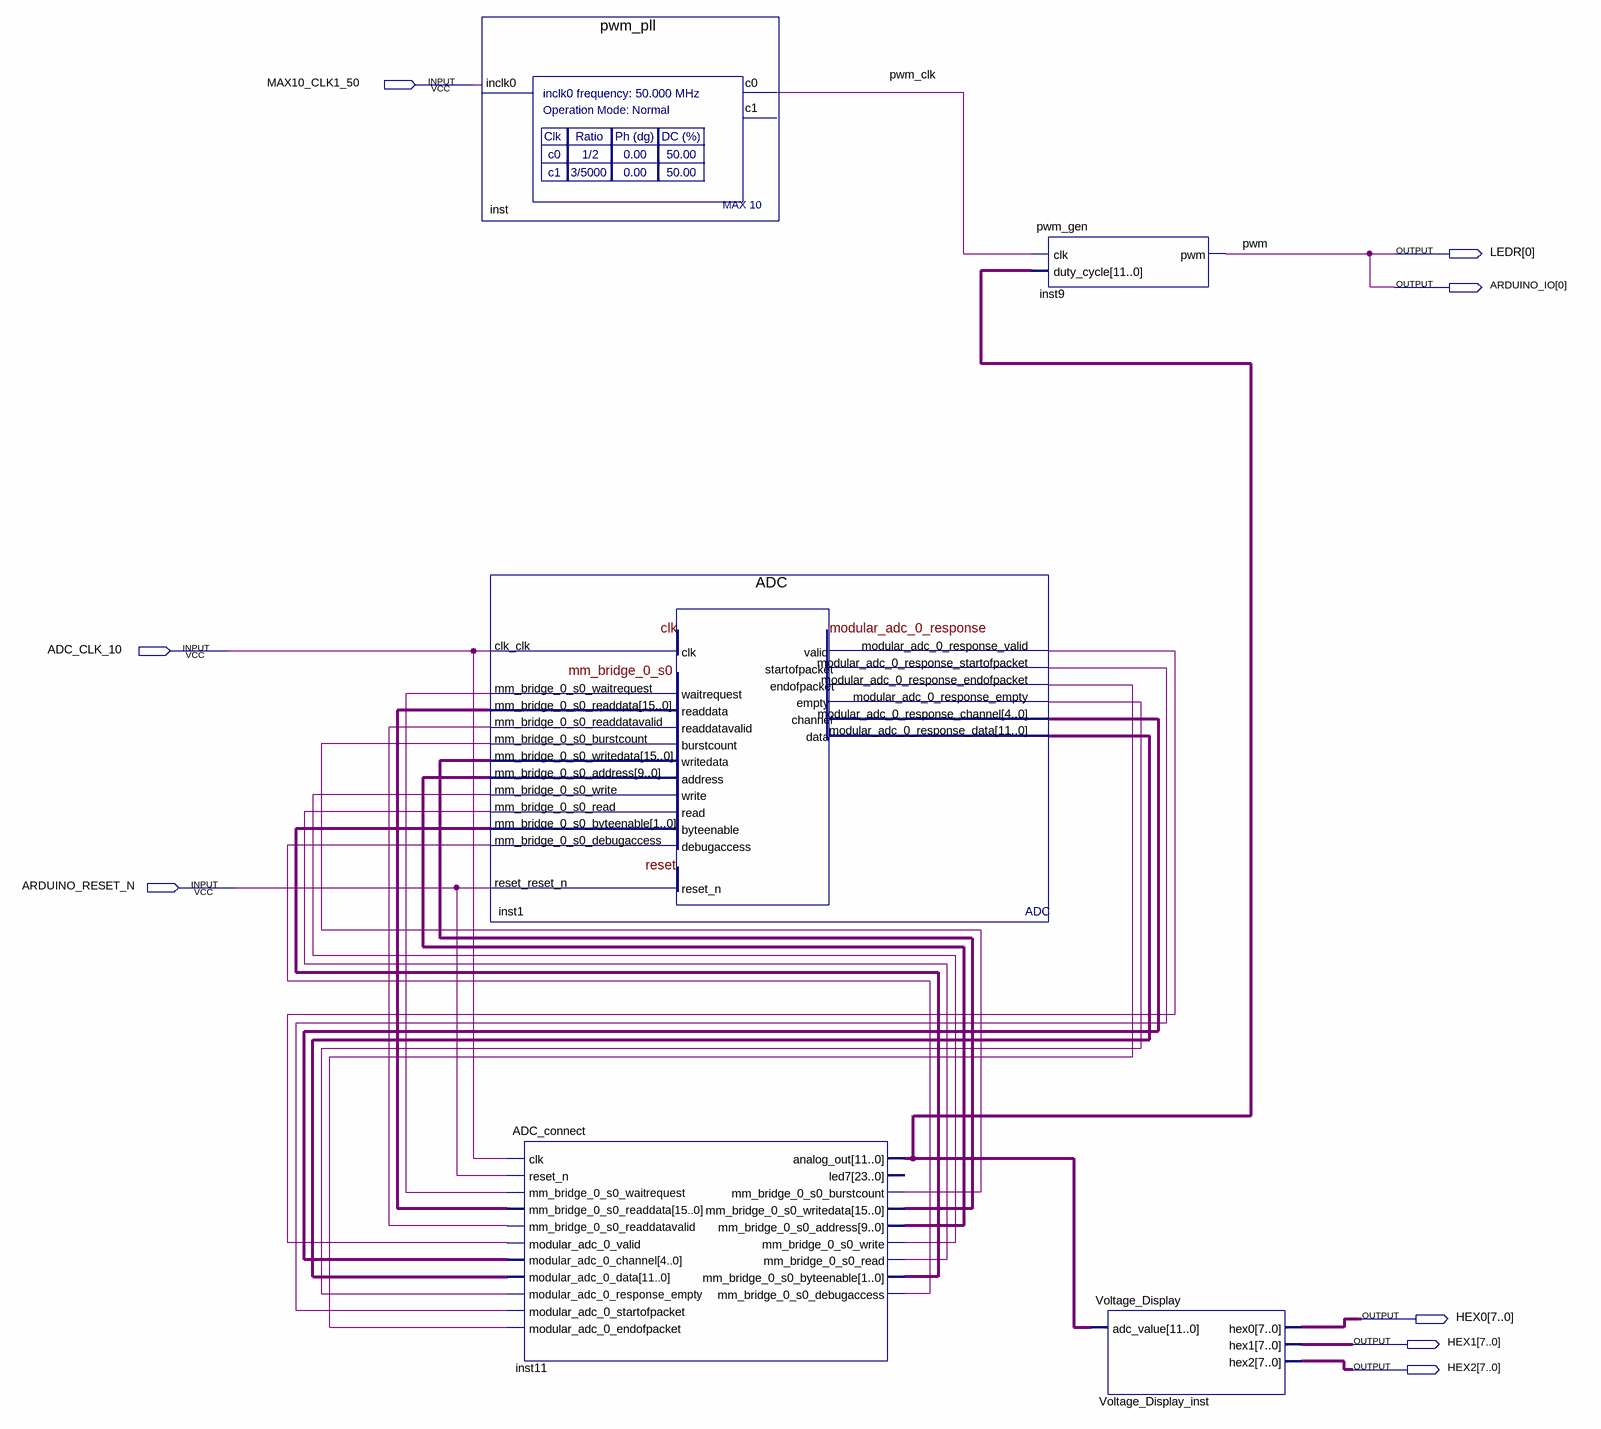
[diagram p0: schematic sheet]
// Quartus schematic pwm_led_top.bdf as structural Verilog: 5 symbols, 8 pins
module pwm_led_top (
  input  MAX10_CLK1_50,
  input  ADC_CLK_10,
  input  ARDUINO_RESET_N,
  output [0:0] LEDR,
  output [0:0] ARDUINO_IO,
  output [7:0] HEX0,
  output [7:0] HEX1,
  output [7:0] HEX2
);

  wire inst1_mm_bridge_0_s0_readdatavalid, inst1_mm_bridge_0_s0_waitrequest,
       inst1_modular_adc_0_response_empty, inst1_modular_adc_0_response_endofpacket,
       inst1_modular_adc_0_response_startofpacket, inst1_modular_adc_0_response_valid,
       inst11_mm_bridge_0_s0_burstcount, inst11_mm_bridge_0_s0_debugaccess, inst11_mm_bridge_0_s0_read,
       inst11_mm_bridge_0_s0_write, pwm_clk;
  wire [1:0] inst11_mm_bridge_0_s0_byteenable;
  wire [4:0] inst1_modular_adc_0_response_channel;
  wire [9:0] inst11_mm_bridge_0_s0_address;
  wire [11:0] inst1_modular_adc_0_response_data, inst11_analog_out;
  wire [15:0] inst1_mm_bridge_0_s0_readdata, inst11_mm_bridge_0_s0_writedata;

  pwm_pll inst (.inclk0(MAX10_CLK1_50), .c0(pwm_clk));  // open: c1
  ADC inst1 (
    .clk_clk(ADC_CLK_10), .mm_bridge_0_s0_burstcount(inst11_mm_bridge_0_s0_burstcount),
    .mm_bridge_0_s0_writedata(inst11_mm_bridge_0_s0_writedata),
    .mm_bridge_0_s0_address(inst11_mm_bridge_0_s0_address),
    .mm_bridge_0_s0_write(inst11_mm_bridge_0_s0_write), .mm_bridge_0_s0_read(inst11_mm_bridge_0_s0_read),
    .mm_bridge_0_s0_byteenable(inst11_mm_bridge_0_s0_byteenable),
    .mm_bridge_0_s0_debugaccess(inst11_mm_bridge_0_s0_debugaccess), .reset_reset_n(ARDUINO_RESET_N),
    .mm_bridge_0_s0_waitrequest(inst1_mm_bridge_0_s0_waitrequest),
    .mm_bridge_0_s0_readdata(inst1_mm_bridge_0_s0_readdata),
    .mm_bridge_0_s0_readdatavalid(inst1_mm_bridge_0_s0_readdatavalid),
    .modular_adc_0_response_valid(inst1_modular_adc_0_response_valid),
    .modular_adc_0_response_startofpacket(inst1_modular_adc_0_response_startofpacket),
    .modular_adc_0_response_endofpacket(inst1_modular_adc_0_response_endofpacket),
    .modular_adc_0_response_empty(inst1_modular_adc_0_response_empty),
    .modular_adc_0_response_channel(inst1_modular_adc_0_response_channel),
    .modular_adc_0_response_data(inst1_modular_adc_0_response_data));
  ADC_connect inst11 (
    .clk(ADC_CLK_10), .reset_n(ARDUINO_RESET_N),
    .mm_bridge_0_s0_waitrequest(inst1_mm_bridge_0_s0_waitrequest),
    .mm_bridge_0_s0_readdata(inst1_mm_bridge_0_s0_readdata),
    .mm_bridge_0_s0_readdatavalid(inst1_mm_bridge_0_s0_readdatavalid),
    .modular_adc_0_valid(inst1_modular_adc_0_response_valid),
    .modular_adc_0_channel(inst1_modular_adc_0_response_channel),
    .modular_adc_0_data(inst1_modular_adc_0_response_data),
    .modular_adc_0_response_empty(inst1_modular_adc_0_response_empty),
    .modular_adc_0_startofpacket(inst1_modular_adc_0_response_startofpacket),
    .modular_adc_0_endofpacket(inst1_modular_adc_0_response_endofpacket), .analog_out(inst11_analog_out),
    .mm_bridge_0_s0_burstcount(inst11_mm_bridge_0_s0_burstcount),
    .mm_bridge_0_s0_writedata(inst11_mm_bridge_0_s0_writedata),
    .mm_bridge_0_s0_address(inst11_mm_bridge_0_s0_address),
    .mm_bridge_0_s0_write(inst11_mm_bridge_0_s0_write), .mm_bridge_0_s0_read(inst11_mm_bridge_0_s0_read),
    .mm_bridge_0_s0_byteenable(inst11_mm_bridge_0_s0_byteenable),
    .mm_bridge_0_s0_debugaccess(inst11_mm_bridge_0_s0_debugaccess));  // open: led7
  pwm_gen inst9 (.clk(pwm_clk), .duty_cycle(inst11_analog_out), .pwm(ARDUINO_IO[0]));
  Voltage_Display Voltage_Display_inst (.adc_value(inst11_analog_out), .hex0(HEX0), .hex1(HEX1), .hex2(HEX2));

  assign LEDR[0] = ARDUINO_IO[0];

  // Other names for the same wires on the sheet: pwm = ARDUINO_IO[0]
endmodule
